# Altium schematic sheet STLink_MODS.SchDoc: Embedded STLink
size A3; CompanyName: Green Team Twente; Organization: Green Team Twente; Revision: V1.1; SheetNumber: 6; SheetTotal: 8; Team: 2024; Subsystem: Embedded Systems
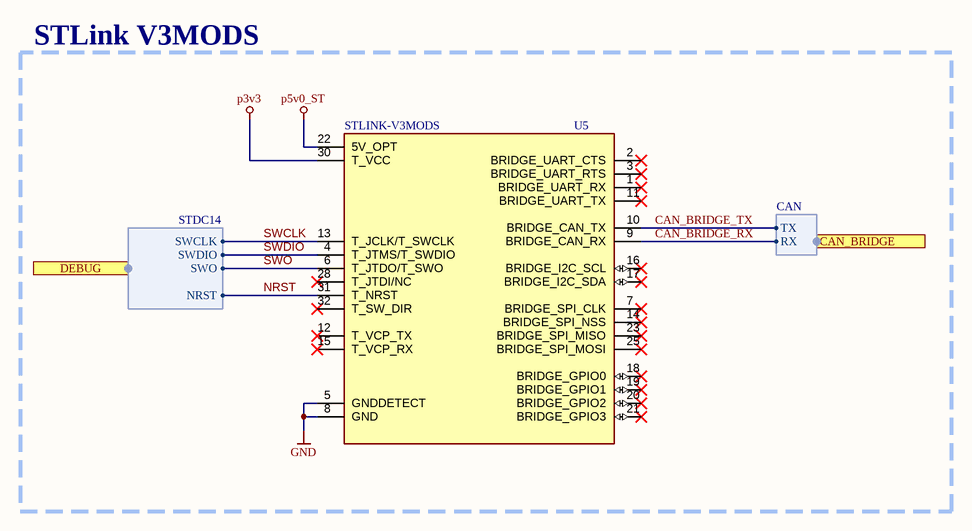
[diagram p0: STLink_MODS.SchDoc]

## Parts
U5  STLINK-V3MODS  [MODULE_STLINK-V3MODS]

## Blocks framed on the sheet
STLink V3MODS: U5

## Ports
CAN_BRIDGE (out, harness CAN), DEBUG (harness STDC14)

## Harnesses
STDC14: SWDIO, SWCLK, NRST, SWO
CAN: RX, TX

## Nets
GND: U5.5(GNDDETECT) U5.8(GND)
p3v3: U5.30(T_VCC)
p5v0_ST: U5.22(5V_OPT)
CAN_BRIDGE_RX: U5.9(BRIDGE_CAN_RX) ; port CAN_BRIDGE.RX
CAN_BRIDGE_TX: U5.10(BRIDGE_CAN_TX) ; port CAN_BRIDGE.TX
NRST: U5.31(T_NRST) ; port DEBUG.NRST
SWCLK: U5.13(T_JCLK/T_SWCLK) ; port DEBUG.SWCLK
SWDIO: U5.4(T_JTMS/T_SWDIO) ; port DEBUG.SWDIO
SWO: U5.6(T_JTDO/T_SWO) ; port DEBUG.SWO

Not connected (* = marked no-connect by the designer): U5 1(BRIDGE_UART_RX)* 2(BRIDGE_UART_CTS)* 3(BRIDGE_UART_RTS)* 7(BRIDGE_SPI_CLK)* 11(BRIDGE_UART_TX)* 12(T_VCP_TX)* 14(BRIDGE_SPI_NSS)* 15(T_VCP_RX)* 16(BRIDGE_I2C_SCL)* 17(BRIDGE_I2C_SDA)* 18(BRIDGE_GPIO0)* 19(BRIDGE_GPIO1)* 20(BRIDGE_GPIO2)* 21(BRIDGE_GPIO3)* 23(BRIDGE_SPI_MISO)* 25(BRIDGE_SPI_MOSI)* 28(T_JTDI/NC)* 32(T_SW_DIR)*

## Notes on the sheet
- Team
- Authors
- Revision
- Title
- Project
- Subsystem
- File
- Sheet
- //

## Library data of the parts
U5 = CMP-00030-00002-9: pin to pad: 8>8+24+26+27+29; Value: *; MP: STLINK-V3MODS; Design Item ID: STLINK-V3MODS; Pins: 32; Component Type: Standard; Price: None; Availability: Unavailable; Case/Package: None; Source: STLINK-V3MODS.SchLib